# Altium project radxa_cm5_io_board_v2200_SCH-1.PrjPcb (part 3 of 5)

## Sheet 13_USB30_USB20.SchDoc
size 386 x 246 mm
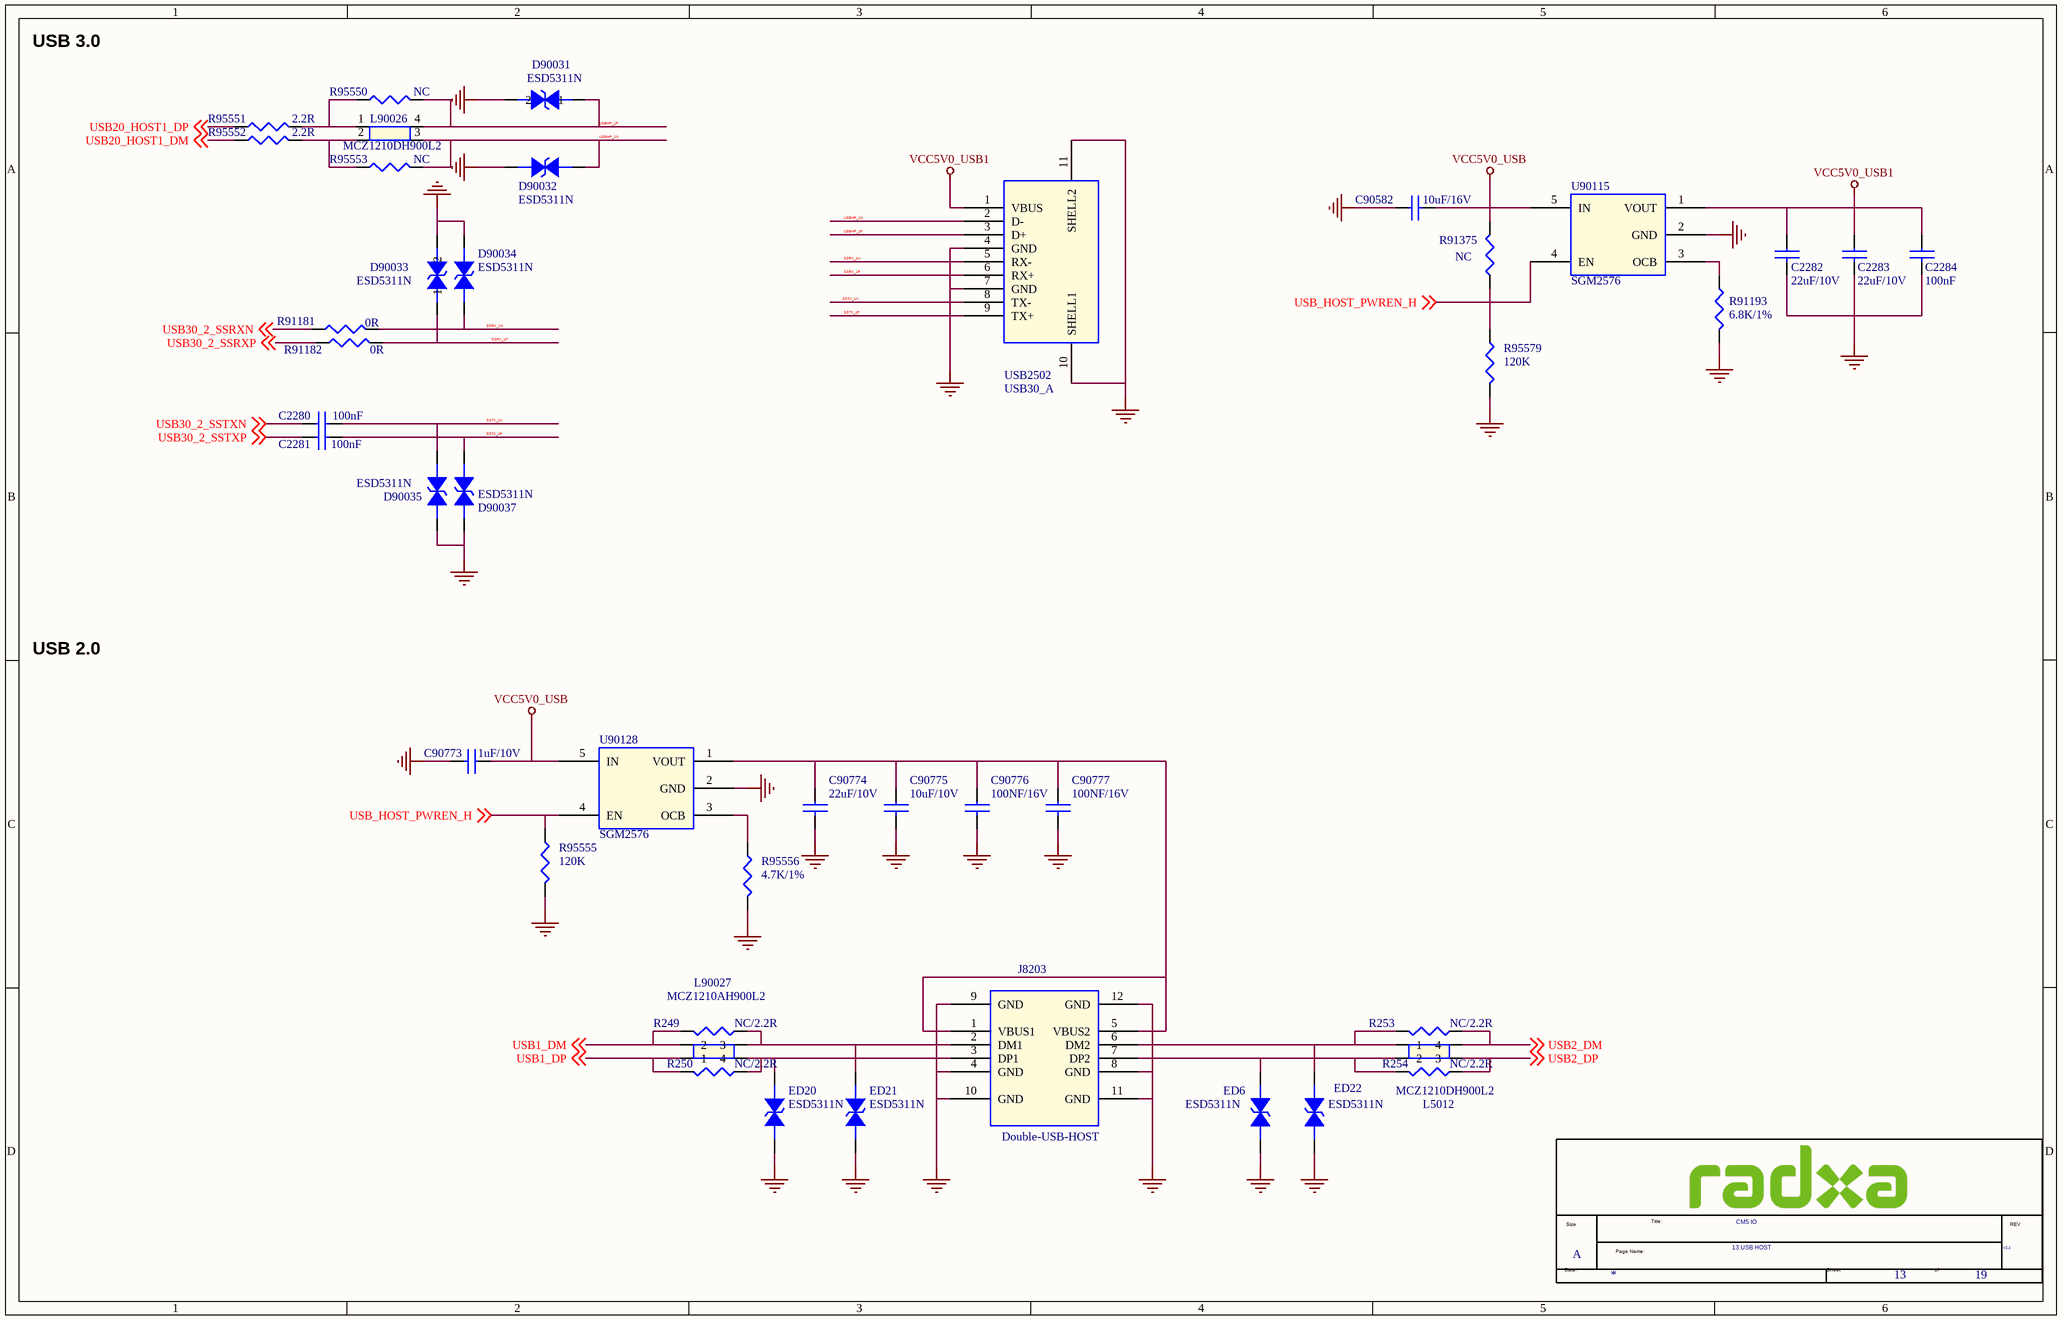
[diagram p12: 13_USB30_USB20.SchDoc]

### Parts
(Parts that share a designator on the sheet are numbered #1, #2 ... from top to bottom, then left to right.)
*#13  Doc: 13.USB HOST  RevCode: V2.2  Title: CM5 IO  Page Size: A  Page Number: 13  Page Count: 19  (hidden comment: radxa_1010)  (graphical)
C2280  100nF  [C0201]
C2281  100nF  [C0201]
C2282  22uF/10V  [C0603]
C2283  22uF/10V  [C0603]
C2284  100nF  [C0201]
C90582  10uF/16V  [C0402]
C90773  1uF/10V  [C0402]
C90774  22uF/10V  [C0603]
C90775  10uF/10V  [C0603]
C90776  100NF/16V  [C0402]
C90777  100NF/16V  [C0402]
D90031  ESD5311N  [ESD0402]
D90032  ESD5311N  [ESD0402]
D90033  ESD5311N  [ESD0402]
D90034  ESD5311N  [ESD0402]
D90035  ESD5311N  [ESD0402]
D90037  ESD5311N  [ESD0402]
ED6  ESD5311N  [ESD0402]
ED20  ESD5311N  [ESD0402]
ED21  ESD5311N  [ESD0402]
ED22  ESD5311N  [ESD0402]
J8203  Double-USB-HOST  [USB_DUAL]
L5012  MCZ1210DH900L2  [MCZ1210AH900L2]
L90026  MCZ1210DH900L2  [MCZ1210AH900L2]
L90027  MCZ1210AH900L2  [MCZ1210AH900L2]
R249  NC/2.2R  [R0402]
R250  NC/2.2R  [R0402]
R253  NC/2.2R  [R0402]
R254  NC/2.2R  [R0402]
R91181  0R  [R0402]
R91182  0R  [R0402]
R91193  6.8K/1%  [R0402]
R91375  NC  [R0402]
R95550  NC  [R0402]
R95551  2.2R  [R0402]
R95552  2.2R  [R0402]
R95553  NC  [R0402]
R95555  120K  [R0402]
R95556  4.7K/1%  [R0402]
R95579  120K  [R0402]
U90115  SGM2576  [SOT_23_5]
U90128  SGM2576  [SOT_23_5]
USB2502  USB30_A  [USB30]

### Nets
GND: C2282.2 C2283.2 C2284.2 C90582.1 C90773.2 C90774.2 C90775.2 C90776.2 C90777.2 D90031.2 D90032.2 D90033.2 D90034.2 D90035.2 D90037.2 ED6.2 ED20.2 ED21.2 ED22.2 J8203.4(GND) J8203.8(GND) J8203.9(GND) J8203.10(GND) J8203.11(GND) J8203.12(GND) R91193.2 R95555.2 R95556.2 R95579.2 U90115.2(GND) U90128.2(GND) USB2502.4(GND) USB2502.7(GND) USB2502.10(SHELL1) USB2502.11(SHELL2)
VCC5V0_USB: C90582.2 C90773.1 R91375.1 U90115.5(IN) U90128.5(IN)
VCC5V0_USB1: C2282.1 C2283.1 C2284.1 U90115.1(VOUT) USB2502.1(VBUS)
SSRX_1N: D90034.1 R91181.2 USB2502.5(RX-)
SSRX_1P: D90033.1 R91182.2 USB2502.6(RX+)
SSTX_1N: C2280.2 D90035.1 USB2502.8(TX-)
SSTX_1P: C2281.2 D90037.1 USB2502.9(TX+)
USB1_DM: L90027.2 R249.2 ; off-sheet USB1_DM
USB1_DP: L90027.1 R250.2 ; off-sheet USB1_DP
USB2_DM: L5012.4 R253.1 ; off-sheet USB2_DM
USB2_DP: L5012.3 R254.1 ; off-sheet USB2_DP
USB20_HOST1_DM: R95552.1 ; off-sheet USB20_HOST1_DM
USB20_HOST1_DP: R95551.1 ; off-sheet USB20_HOST1_DP
USB30_2_SSRXN: R91181.1 ; off-sheet USB30_2_SSRXN
USB30_2_SSRXP: R91182.1 ; off-sheet USB30_2_SSRXP
USB30_2_SSTXN: C2280.1 ; off-sheet USB30_2_SSTXN
USB30_2_SSTXP: C2281.1 ; off-sheet USB30_2_SSTXP
USB_HOST_PWREN_H: R91375.2 R95555.1 R95579.1 U90115.4(EN) U90128.4(EN) ; off-sheet USB_HOST_PWREN_H
USBHP_1N: D90032.1 L90026.3 R95553.2 USB2502.2(D-)
USBHP_1P: D90031.1 L90026.4 R95550.2 USB2502.3(D+)
NetC90774_1: C90774.1 C90775.1 C90776.1 C90777.1 J8203.1(VBUS1) J8203.5(VBUS2) U90128.1(VOUT)
NetED6_1: ED6.1 J8203.7(DP2) L5012.2 R254.2
NetED20_1: ED20.1 J8203.3(DP1) L90027.4 R250.1
NetED21_1: ED21.1 J8203.2(DM1) L90027.3 R249.1
NetED22_1: ED22.1 J8203.6(DM2) L5012.1 R253.2
NetL90026_1: L90026.1 R95550.1 R95551.2
NetL90026_2: L90026.2 R95552.2 R95553.1
NetR91193_1: R91193.1 U90115.3(OCB)
NetR95556_1: R95556.1 U90128.3(OCB)

### Notes on the sheet
- USB 3.0
- USB 2.0
- (in symbol radxa_1010) Size; Title:; REV; Page Name:; Date:; Sheet; of

### Library data of the parts
C2280 = CAP NP_0_Dup1: cap,100.00nF,+/-10%,10V,X5R,C0201; Manufacturer PN: C0603X5R1A104K030BC; Manufacturer: TDK; C_Voltage: 6.3V; Tolerance: 10%; Priority: A; Number: 37; Dielectric: X5R; PCB Footprint: C0201; Voltage: 10V; Created by: JJJ; Part Type: C0201; RK PN: C0603X5R1A104K030BC
C2281 = CAP NP_0_Dup1: cap,100.00nF,+/-10%,10V,X5R,C0201; Manufacturer: TDK; Number: 37; RK PN: C0603X5R1A104K030BC; Priority: A; Tolerance: 10%; C_Voltage: 6.3V; Dielectric: X5R; PCB Footprint: C0201; Voltage: 10V; Part Type: C0201; Manufacturer PN: C0603X5R1A104K030BC; Created by: JJJ
C2282 = CAP NP_0_Dup1: cap,100.00nF,+/-10%,10V,X5R,C0402; Manufacturer: TDK; RK PN: C1005X5R1A104K050BA; Priority: A; Tolerance: 10%; Dielectric: X5R; PCB Footprint: C0603; Voltage: 10V; Part Type: C0402; Manufacturer PN: C1005X5R1A104K050BA; Created by: JJJ
C2283 C2284 = CAP NP_0_Dup1: cap,100.00nF,+/-10%,10V,X5R,C0402; Manufacturer PN: C1005X5R1A104K050BA; Manufacturer: TDK; Tolerance: 10%; Priority: A; Dielectric: X5R; Voltage: 10V; Created by: JJJ; Part Type: C0402; RK PN: C1005X5R1A104K050BA
  C2283: PCB Footprint: C0603
  C2284: PCB Footprint: C0201
C90582 = C / 10 / uF / 0402_0: 0402 ∮20% 10uF X5R 6.3V; FunctionGroup: Petrus / PMIC; Vendor: Murata; Vendor_PN: GRM155R60J106ME05; FS: Y; PCB Footprint: C0603; Property1: ∮20%; Property2: X5R; Property3: 6.3V; EBOM: C / 10 / uF / 0402
C90773 = CAP NP_0_Dup2: cap,1.00uF,+/-10%,10V,X5R,C0402; Manufacturer PN: C1005X5R1A105K050BB; Manufacturer: TDK; Tolerance: 10%; C_Voltage: 6.3V; Priority: A; Voltage: 10V; PCB Footprint: C0402; Dielectric: X5R; Created by: JJJ; Part Type: C0402; RK PN: C1005X5R1A105K050BB
C90774 = CAP NP_0_Dup2: cap,22.00uF,+/-20%,10V,X5R,C0603; Manufacturer PN: C1608X5R1A226M080AC; Manufacturer: TDK; Tolerance: 20%; Priority: A; Voltage: 10V; PCB Footprint: C0603; Dielectric: X5R; Created by: JJJ; Part Type: C0603; RK PN: C1608X5R1A226M080AC
C90775 = CAP NP_0_Dup2: cap,10.00uF,+/-10%,10V,X5R,C0603; Manufacturer: TDK; RK PN: C1608X5R1A106K080AC; Priority: A; Tolerance: 10%; Voltage: 10V; PCB Footprint: C0603; Dielectric: X5R; Part Type: C0603; Manufacturer PN: C1608X5R1A106K080AC; Created by: JJJ
C90776 C90777 = CAP NP_0_Dup2: cap,100.00nF,+/-10%,16V,X5R,C0402; Manufacturer: TDK; RK PN: C1005X5R1C104K050BA; Priority: A; Tolerance: 10%; Voltage: 16V; PCB Footprint: C0402; Dielectric: X5R; Part Type: C0402; Manufacturer PN: C1005X5R1C104K050BA; Created by: JJJ
D90031 = DIODE BI_DIR TRIG_0: 1-Line, Bi-directional, Transient Voltage Suppressors.1pF.; Manufacturer: WillSemi(韦尔半导体); Manufacturer PN: ESD5341N; Priority: A; PCB Footprint: ESD0402; Created by: JJJ; Part Type: ESD_TVS; RK PN: ESD5341N
D90032 D90034 ED22 = DIODE BI_DIR TRIG_1_Dup1: 1-Line, Bi-directional, Transient Voltage Suppressors.1pF.; Manufacturer: WillSemi(韦尔半导体); Manufacturer PN: ESD5341N; Priority: A; PCB Footprint: ESD0402; Created by: JJJ; Part Type: ESD_TVS; RK PN: ESD5341N
D90033 = DIODE BI_DIR TRIG_1: 1-Line, Bi-directional, Transient Voltage Suppressors.1pF.; Manufacturer: WillSemi(韦尔半导体); Manufacturer PN: ESD5341N; Priority: A; PCB Footprint: ESD0402; Created by: JJJ; Part Type: ESD_TVS; RK PN: ESD5341N
D90035 D90037 ED6 ED20 ED21 = DIODE BI_DIR TRIG_1_Dup1: 1-Line, Bi-directional, Transient Voltage Suppressors.1pF.; Manufacturer: WillSemi(韦尔半导体); RK PN: ESD5341N; Priority: A; PCB Footprint: ESD0402; Part Type: ESD_TVS; Manufacturer PN: ESD5341N; Created by: JJJ
J8203 = Double-USB: PCB Footprint: USB_DUAL
L5012 L90027 = MCZ1210AH900L2_3: PCB Footprint: MCZ1210AH900L2
L90026 = MCZ1210AH900L2_1_Dup1: PCB Footprint: MCZ1210AH900L2
R249 R250 R253 R254 = RESISTOR_1_Dup1: 通用厚膜电阻,2R2,+/-5%,R0402,1/16W.; Manufacturer: YAGEO; Tolerance: 5%; RK PN: RC0402JR-072R2L; Priority: A; Wattage: 1/16W; PCB Footprint: R0402; Part Type: 通用厚膜电阻; Manufacturer PN: RC0402JR-072R2L; Created by: YTL
R91181 = RESISTOR_0_Dup1: 通用厚膜电阻,0R,+/-5%,R0201,1/20W.; Manufacturer PN: RC0201JR-070RL; Manufacturer: YAGEO; Tolerance: 5%; Wattage: 1/20W; Priority: A; PCB Footprint: R0201; Created by: YTL; Part Type: 通用厚膜电阻; RK PN: RC0201JR-070RL
R91182 = RESISTOR_0_Dup1: 通用厚膜电阻,0R,+/-5%,R0201,1/20W.; Manufacturer: YAGEO; Tolerance: 5%; RK PN: RC0201JR-070RL; Priority: A; Wattage: 1/20W; PCB Footprint: R0201; Part Type: 通用厚膜电阻; Manufacturer PN: RC0201JR-070RL; Created by: YTL
R91193 = RESISTOR_0_Dup1: 通用厚膜电阻,4K7,+/-5%,R0402,1/16W.; Manufacturer: YAGEO; Tolerance: 1%; PCB Footprint: R0201; RK PN: RC0402JR-074K7L; Priority: A; Wattage: 1/16W; Part Type: 通用厚膜电阻; Manufacturer PN: RC0402JR-074K7L; Created by: YTL
R91375 = RESISTOR_0_Dup1: Did Not Place.; Manufacturer PN: DNP0402; Tolerance: 0%; PCB Footprint: R0201; Priority: A; Created by: JJJ; Part Type: DNP; RK PN: DNP0402
R95550 R95552 R95553 = RESISTOR_0_Dup1: 通用厚膜电阻,2R2,+/-5%,R0402,1/16W.; Manufacturer PN: RC0402JR-072R2L; Manufacturer: YAGEO; Tolerance: 5%; Wattage: 1/16W; Priority: A; PCB Footprint: R0402; Created by: YTL; Part Type: 通用厚膜电阻; RK PN: RC0402JR-072R2L
R95551 = RESISTOR_0_Dup1: 通用厚膜电阻,2R2,+/-5%,R0402,1/16W.; Manufacturer: YAGEO; Tolerance: 5%; RK PN: RC0402JR-072R2L; Priority: A; Wattage: 1/16W; PCB Footprint: R0402; Part Type: 通用厚膜电阻; Manufacturer PN: RC0402JR-072R2L; Created by: YTL
R95555 R95579 = RESISTOR_1_Dup1: 通用厚膜电阻,100K,+/-5%,R0402,1/16W.; Manufacturer PN: RC0402JR-07100KL; Manufacturer: YAGEO; PCB Footprint: R0201; Tolerance: 5%; Wattage: 1/16W; Priority: A; Created by: YTL; Part Type: 通用厚膜电阻; RK PN: RC0402JR-07100KL
R95556 = RESISTOR_1_Dup1: 通用厚膜电阻,10K,+/-1%,R0402,1/16W.; Manufacturer PN: RC0402FR-0710KL; Manufacturer: YAGEO; PCB Footprint: R0201; Tolerance: 1%; Wattage: 1/16W; Priority: A; Created by: YTL; Part Type: 通用厚膜电阻; RK PN: RC0402FR-0710KL
U90115 U90128 = SWITCH_SY6280: Low Loss Power Distribution Switch; Manufacturer: Silergy（矽力杰）; RK PN: SY6280AAC; Priority: A; PCB Footprint: SOT_23_5; Part Type: Switch; Manufacturer PN: SY6280AAC; Created by: JJJ
USB2502 = USB30_TYPE_A: A型USB3.0座，卧式，插焊; Manufacturer: 旺科达; PCB Footprint: USB30-L1; RK PN: USB-HOST_30; Priority: A; Part Type: USB Jack; Manufacturer Part Number: USB30_A; Created by: JJJ
*#13 = radxa_1010: Page Create Date: March  8, 1995; Page Modify Date: *

## Sheet 14_FAN_RTC.SchDoc
size 297 x 209 mm
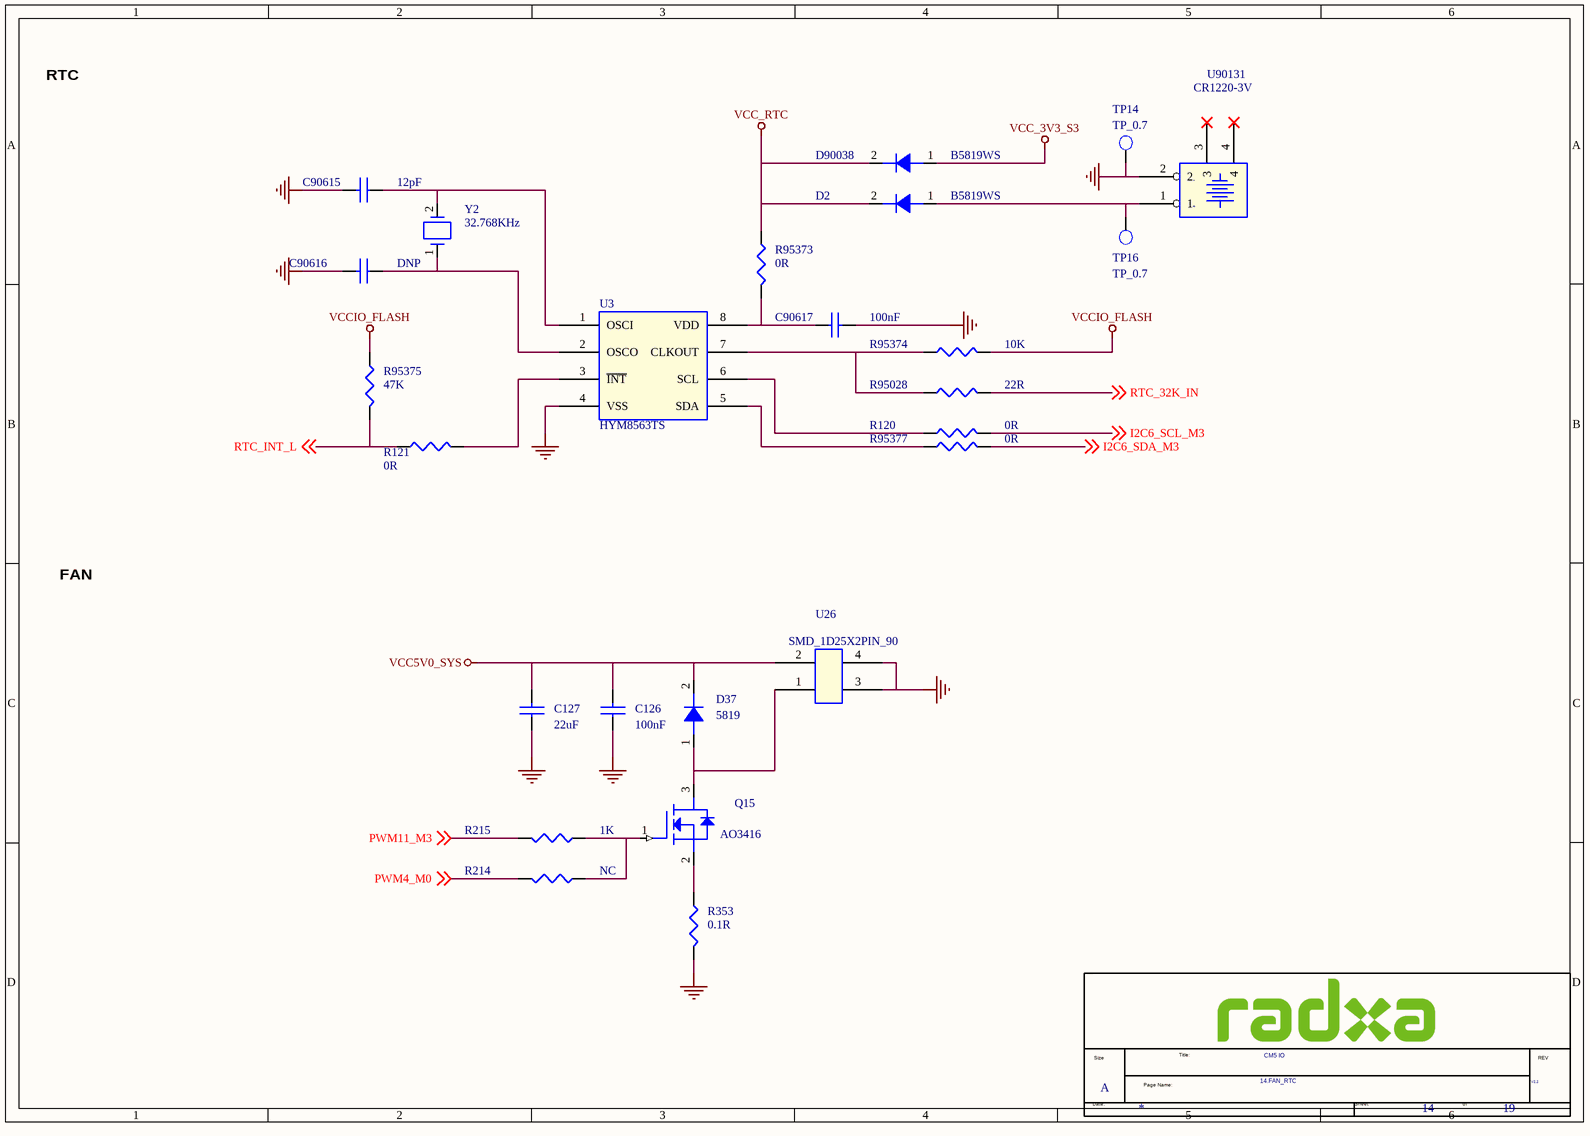
[diagram p13: 14_FAN_RTC.SchDoc]

### Parts
(Parts that share a designator on the sheet are numbered #1, #2 ... from top to bottom, then left to right.)
*#14  Doc: 14.FAN_RTC  RevCode: V2.2  Title: CM5 IO  Page Size: A  Page Number: 14  Page Count: 19  (hidden comment: radxa_1010)  (graphical)
C126  100nF  [C0402]
C127  22uF  [C0603]
C90615  12pF  [C0402]
C90616  DNP  [C0402]
C90617  100nF  [C0402]
D2  B5819WS  [SOD_323]
D37  5819  [SOD_123]
D90038  B5819WS  [SOD_323]
Q15  AO3416  [SOT23]
R120  0R  [R0402]
R121  0R  [R0402]
R214  NC  [R0402]
R215  1K  [R0402]
R353  0.1R  [R0402]
R95028  22R  [R0402]
R95373  0R  [R0402]
R95374  10K  [R0402]
R95375  47K  [R0402]
R95377  0R  [R0402]
TP14  TP_0.7  [TEST]
TP16  TP_0.7  [TEST]
U3  HYM8563TS  [TSSOP8_3R10X3R10X1R10]
U26  SMD_1D25X2PIN_90  [SMD_1D25X2PIN_90]
U90131  CR1220-3V  [BATTERY-20MM]
Y2  32.768KHz  [3215_2pin]

### Nets
GND: C126.1 C127.1 C90615.2 C90616.2 C90617.2 R353.2 TP14.1 U3.4(VSS) U26.3 U26.4 U90131.2
VCC5V0_SYS: C126.2 C127.2 D37.2(K) U26.2
VCC_3V3_S3: D90038.1(A)
VCC_RTC: D2.2(K) D90038.2(K) R95373.1
VCCIO_FLASH: R95374.2 R95375.1
I2C6_SCL_M3: R120.2 ; off-sheet I2C6_SCL_M3
I2C6_SDA_M3: R95377.2 ; off-sheet I2C6_SDA_M3
PWM4_M0: R214.2 ; off-sheet PWM4_M0
PWM11_M3: R215.2 ; off-sheet PWM11_M3
RTC_32K_IN: R95028.2 ; off-sheet RTC_32K_IN
RTC_INT_L: R121.1 R95375.2 ; off-sheet RTC_INT_L
NetC90615_1: C90615.1 U3.1(OSCI) Y2.2
NetC90616_1: C90616.1 U3.2(OSCO) Y2.1
NetC90617_1: C90617.1 R95373.2 U3.8(VDD)
NetD2_1: D2.1(A) TP16.1 U90131.1
NetD37_1: D37.1(A) Q15.3(DRAIN) U26.1
NetQ15_1: Q15.1(GATE) R214.1 R215.1
NetQ15_2: Q15.2(SOURCE) R353.1
NetR120_1: R120.1 U3.6(SCL)
NetR121_2: R121.2 U3.3(~{INT})
NetR95028_1: R95028.1 R95374.1 U3.7(CLKOUT)
NetR95377_1: R95377.1 U3.5(SDA)

Not connected (* = marked no-connect by the designer): U90131 3* 4*

### Notes on the sheet
- RTC
- FAN
- (in symbol CON_BATTERY-20MM_0) -; +
- (in symbol radxa_1010) Size; Title:; REV; Page Name:; Date:; Sheet; of

### Library data of the parts
C126 = CAP NP_0: cap,100.00nF,+/-10%,16V,X5R,C0402; Manufacturer PN: C1005X5R1C104K050BA; Manufacturer: TDK; Voltage: 25V; Tolerance: 10%; Priority: A; PCB Footprint: C0402; Dielectric: X5R; Created by: JJJ; Part Type: C0402; RK PN: C1005X5R1C104K050BA
C127 = CAP NP_0: cap,22.00uF,+/-10%,10V,X5R,C0805; Manufacturer: TDK; Voltage: 25V; RK PN: C2012X5R1A226K125AB; Priority: A; Tolerance: 10%; PCB Footprint: C0603; Dielectric: X5R; Part Type: C0805; Manufacturer PN: C2012X5R1A226K125AB; Created by: JJJ
C90615 = CAP NP_0: cap,12.00pF,+/-5%,50V,C0G,C0402; Manufacturer: TDK; RK PN: C1005C0G1H120J050BA; Priority: A; Tolerance: 5%; Voltage: 50V; PCB Footprint: C0402; Dielectric: C0G; Part Type: C0402; Manufacturer PN: C1005C0G1H120J050BA; Created by: JJJ
C90616 = CAP NP_0: Did Not Place.; Manufacturer PN: DNPC0402; Priority: A; PCB Footprint: C0402; Created by: JJJ; Part Type: DNP; RK PN: DNPC0402
C90617 = CAP NP_0: cap,100.00nF,+/-10%,16V,X5R,C0402; Manufacturer PN: C1005X5R1C104K050BA; Manufacturer: TDK; C_Voltage: 6.3V; Tolerance: 10%; Priority: A; Number: 37; Voltage: 16V; PCB Footprint: C0402; Dielectric: X5R; Created by: JJJ; Part Type: C0402; RK PN: C1005X5R1C104K050BA
D2 D37 D90038 = DIODE_Dup1: Schottky Barrier，B5819WS SOD-323; Manufacturer: 长电; Priority: A; Created by: JJJ; Manufacturer PN: B5819WS; Part Type: Schottky rectifier; RK PN: B5819WS
  D2 D90038: PCB Footprint: SOD_323
  D37: PCB Footprint: SOD_123
Q15 = MOSFET N: MOSFET-N,WNM3003 ,30V,+/-20V,4.0A,33m Ohm@Vgs=10V,43m Ohm@Vgs=4.5V,SOT23; PCB Footprint: SOT23
R120 R121 = RESISTOR_1: 通用厚膜电阻,0R,+/-5%,R0402,1/16W.; Manufacturer: YAGEO; Tolerance: 5%; RK PN: RC0402JR-070RL; Priority: A; Wattage: 1/16W; PCB Footprint: R0402; Part Type: 通用厚膜电阻; Manufacturer PN: RC0402JR-070RL; Created by: YTL
R214 R95375 = RESISTOR_1: 通用厚膜电阻,47K,+/-5%,R0402,1/16W.; Manufacturer: YAGEO; Tolerance: 5%; RK PN: RC0402JR-0747KL; Priority: A; Wattage: 1/16W; PCB Footprint: R0402; Part Type: 通用厚膜电阻; Manufacturer PN: RC0402JR-0747KL; Created by: YTL
R215 = RESISTOR_1: 通用厚膜电阻,47K,+/-5%,R0402,1/16W.; Manufacturer PN: RC0402JR-0747KL; Manufacturer: YAGEO; Tolerance: 5%; Wattage: 1/16W; Priority: A; PCB Footprint: R0402; Created by: YTL; Part Type: 通用厚膜电阻; RK PN: RC0402JR-0747KL
R353 = RESISTOR_0: 通用厚膜电阻,10K,+/-5%,R0402,1/16W.; Manufacturer PN: RC0402JR-0710KL; Manufacturer: YAGEO; PCB Footprint: R1206; Tolerance: 5%; Wattage: 1/16W; Priority: A; Created by: YTL; Part Type: 通用厚膜电阻; RK PN: RC0402JR-0710KL
R95028 = RESISTOR_1: 通用厚膜电阻,10K,+/-5%,R0402,1/16W.; Manufacturer PN: RC0402JR-0710KL; Manufacturer: YAGEO; Tolerance: 5%; Wattage: 1/16W; Priority: A; PCB Footprint: R0402; Created by: YTL; Part Type: 通用厚膜电阻; RK PN: RC0402JR-0710KL
R95373 = RESISTOR_1: 通用厚膜电阻,0R,+/-1%,R0603,1/10W.; Manufacturer PN: RC0603FR-070RL; Manufacturer: YAGEO; Tolerance: 1%; Wattage: 1/10W; Priority: A; PCB Footprint: R0603; Created by: YTL; Part Type: 通用厚膜电阻; RK PN: RC0603FR-070RL
R95374 = RESISTOR_1: 通用厚膜电阻,10K,+/-5%,R0402,1/16W.; Manufacturer: YAGEO; Tolerance: 5%; RK PN: RC0402JR-0710KL; Priority: A; Wattage: 1/16W; PCB Footprint: R0402; Part Type: 通用厚膜电阻; Manufacturer PN: RC0402JR-0710KL; Created by: YTL
R95377 = RESISTOR_1: 通用厚膜电阻,0R,+/-5%,R0402,1/16W.; Manufacturer PN: RC0402JR-070RL; Manufacturer: YAGEO; Tolerance: 5%; Wattage: 1/16W; Priority: A; PCB Footprint: R0402; Created by: YTL; Part Type: 通用厚膜电阻; RK PN: RC0402JR-070RL
TP14 = TP: Test Point 0.7mm; PCB Footprint: TP_0R70; RK PN: TESTPOINT_0R7; Priority: A; Part Type: TP; Created by: JJJ
TP16 = TP: Test Point 0.7mm; PCB Footprint: TP_0R70; Priority: A; RK PN: TESTPOINT_0R7; Created by: JJJ; Part Type: TP
U3 = RTC_HYM8563: I2C Real Time Clock/Calendar; Manufacturer: Haoyu（昊昱微电子）; Priority: A; PCB Footprint: TSSOP8_3R10X3R10X1R10; Created by: JJJ; Manufacturer PN: HYM8563TS; Part Type: RTC; RK PN: HYM8563TS
U26 = CON3_6: PCB Footprint: SMD_1D25X2PIN_90
U90131 = CON_BATTERY-20MM_0: PCB Footprint: BAT_CR1220
Y2 = CRYSTAL_2P: 无源晶振，32.768KHz,±20ppm，12.5pF; Manufacturer: TKD(泰晶); RK PN: SF-3215; Priority: A; PCB Footprint: 3215_2pin; Part Type: CRYSTAL; Manufacturer PN: SF-3215; Created by: YWQ
*#14 = radxa_1010: Page Create Date: March  8, 1995; Page Modify Date: *

## Sheet 15_Power_DCIN.SchDoc
size 420 x 297 mm
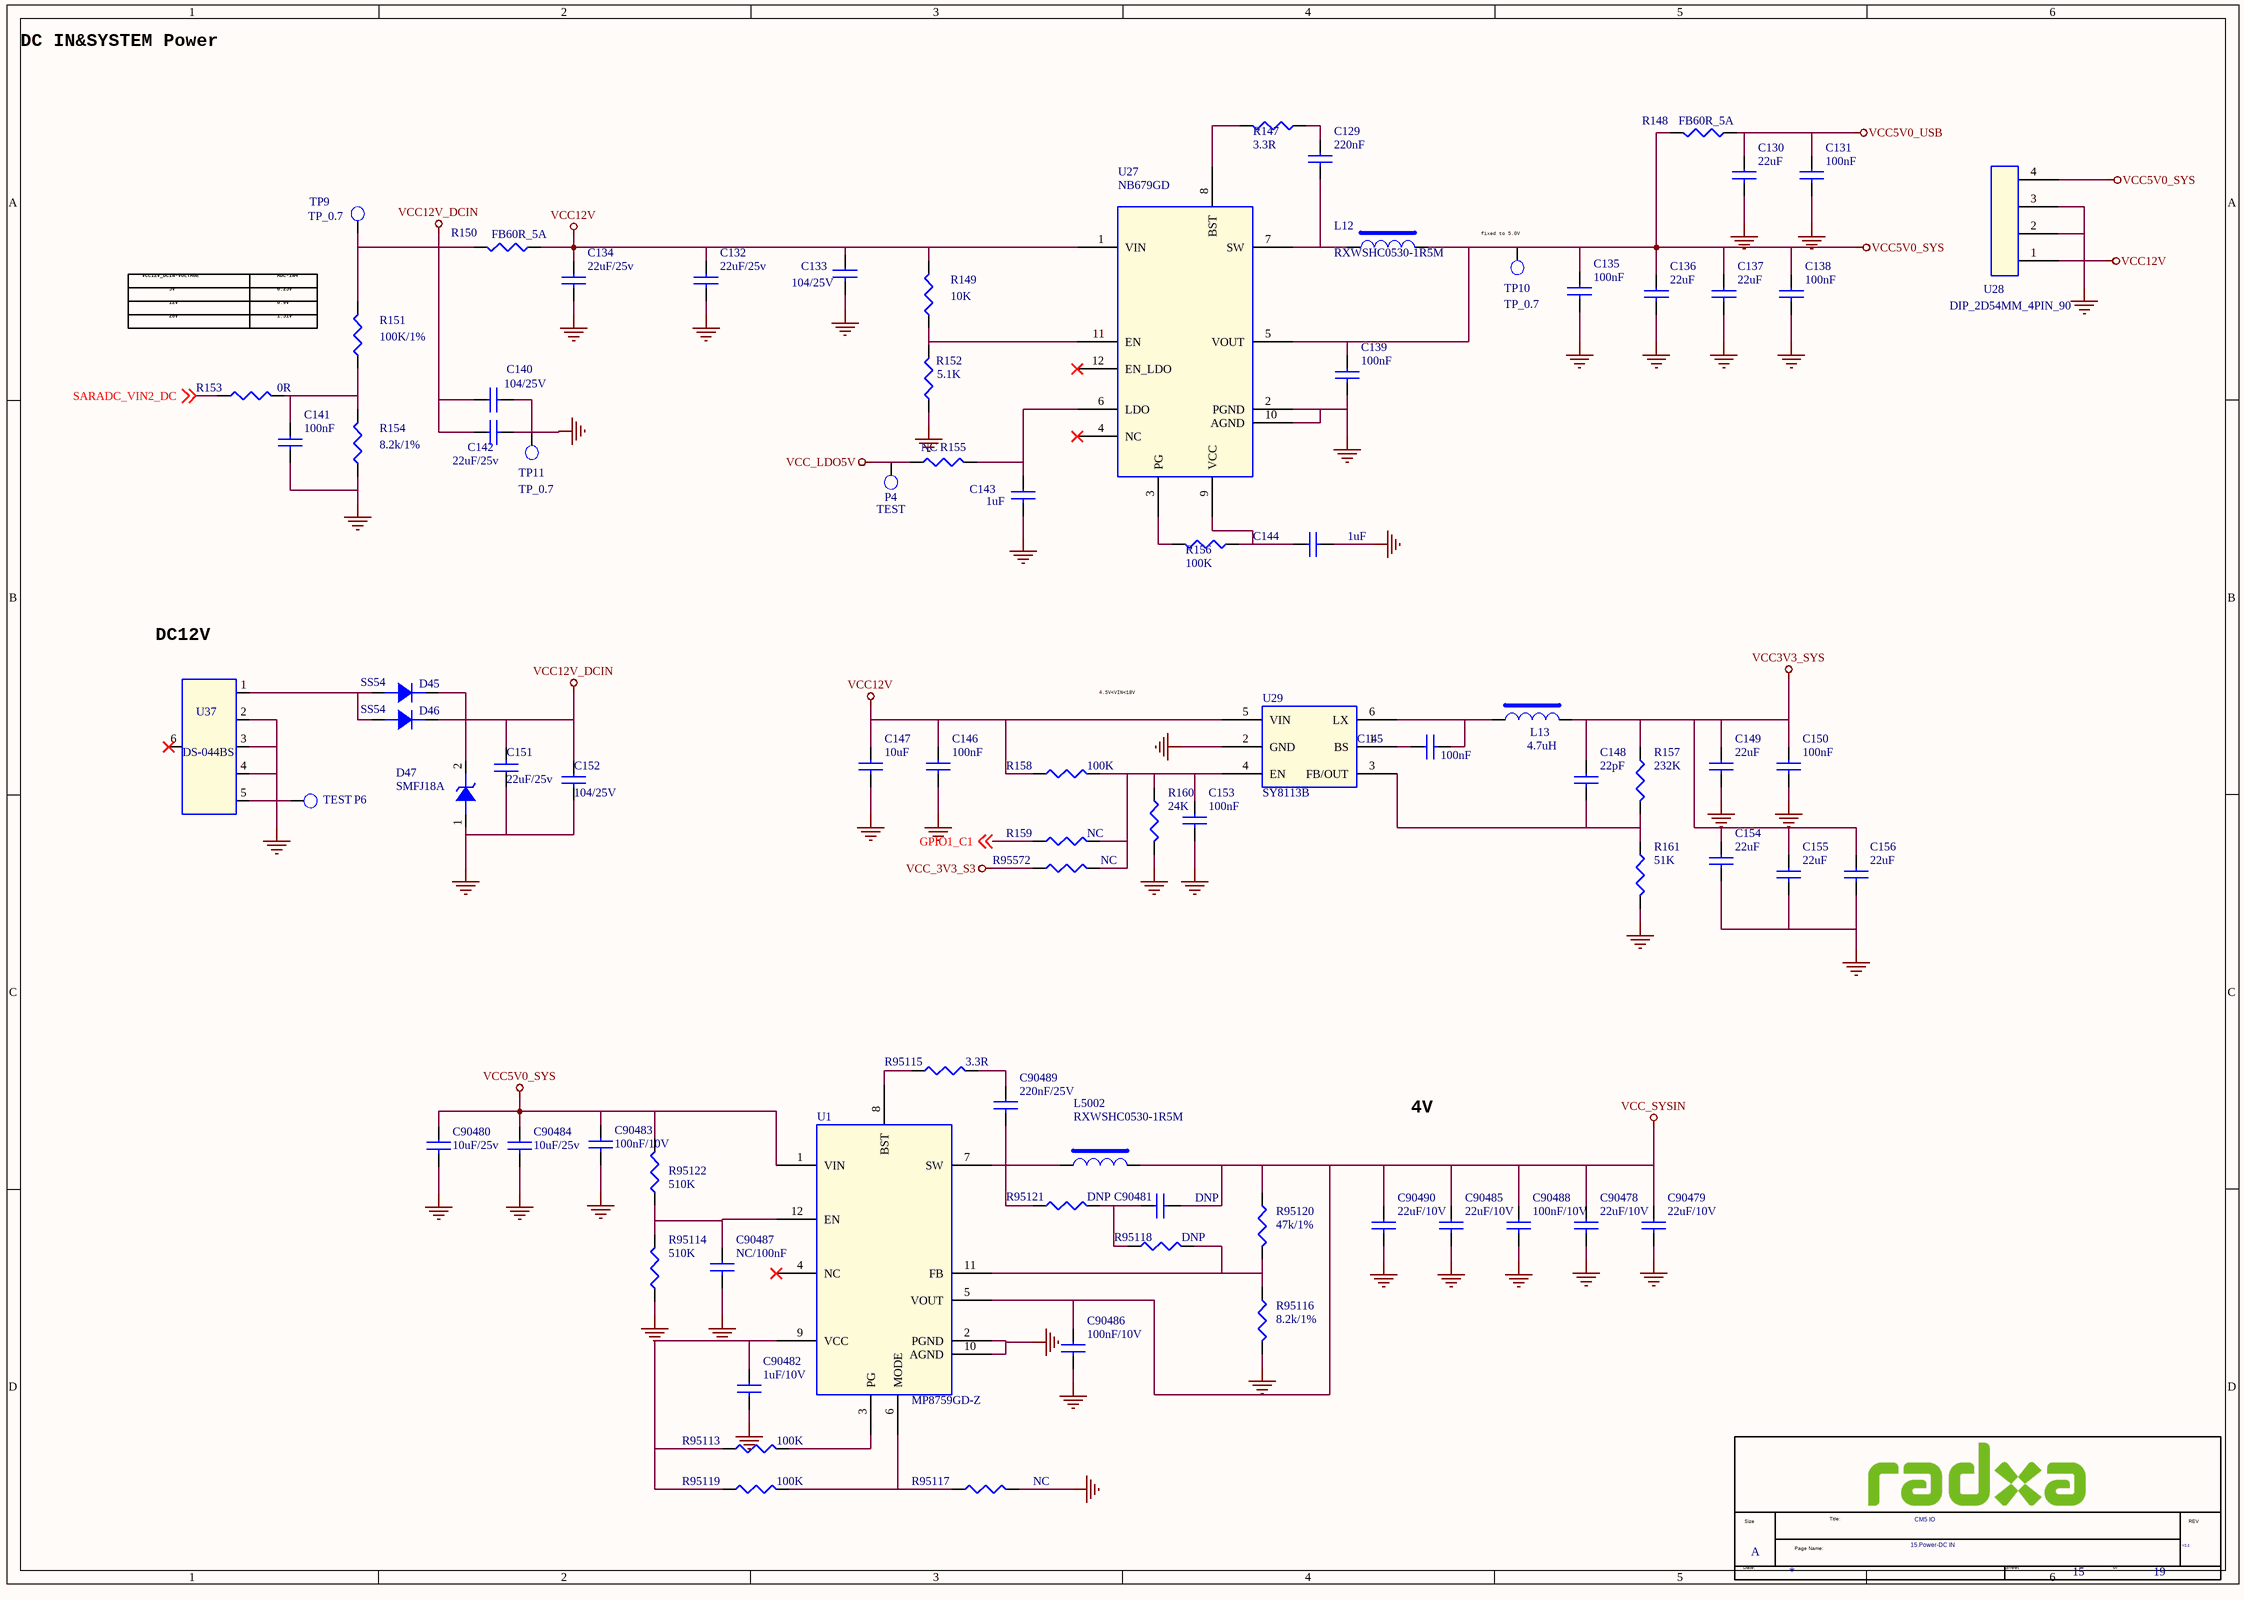
[diagram p14: 15_Power_DCIN.SchDoc]

### Parts
(Parts that share a designator on the sheet are numbered #1, #2 ... from top to bottom, then left to right.)
*#15  Doc: 15.Power-DC IN  RevCode: V2.2  Title: CM5 IO  Page Size: A  Page Number: 15  Page Count: 19  (hidden comment: radxa_1010)  (graphical)
C129  220nF  [C0402]
C130  22uF  [C0603]
C131  100nF  [C0402]
C132  22uF/25v  [C0805]
C133  104/25V  [C0402]
C134  22uF/25v  [C0805]
C135  100nF  [C0402]
C136  22uF  [C0603]
C137  22uF  [C0603]
C138  100nF  [C0402]
C139  100nF  [C0402]
C140  104/25V  [C0402]
C141  100nF  [C0402]
C142  22uF/25v  [C0805]
C143  1uF  [C0402]
C144  1uF  [C0402]
C145  100nF  [C0402]
C146  100nF  [C0402]
C147  10uF  [C1206]
C148  22pF  [C0402]
C149  22uF  [C0805]
C150  100nF  [C0402]
C151  22uF/25v  [C0805]
C152  104/25V  [C0402]
C153  100nF  [C0402]
C154  22uF  [C0805]
C155  22uF  [C0805]
C156  22uF  [C0805]
C90478  22uF/10V  [C0805]
C90479  22uF/10V  [C0805]
C90480  10uF/25v  [C1206]
C90481  DNP  [C0201]
C90482  1uF/10V  [C0201]
C90483  100nF/10V  [C0402]
C90484  10uF/25v  [C1206]
C90485  22uF/10V  [C0805]
C90486  100nF/10V  [C0201]
C90487  NC/100nF  [C0201]
C90488  100nF/10V  [C0402]
C90489  220nF/25V  [C0402]
C90490  22uF/10V  [C0805]
D45  SS54  [DO_214AC]
D46  SS54  [DO_214AC]
D47  SMFJ18A  [SOD_123]
L12  RXWSHC0530-1R5M  [IND-5020]
L13  4.7uH  [IND-5020]
L5002  RXWSHC0530-1R5M  [IND-5020]
P4  TEST  [TEST]
P6  TEST  [TEST]
R147  3.3R  [R0402]
R148  FB60R_5A  [R1206]
R149  10K  [R0402]
R150  FB60R_5A  [R1206]
R151  100K/1%  [R0402]
R152  5.1K  [R0402]
R153  0R  [R0402]
R154  8.2k/1%  [R0402]
R155  NC  [R0402]
R156  100K  [R0402]
R157  232K  [R0402]
R158  100K  [R0402]
R159  NC  [R0402]
R160  24K  [R0402]
R161  51K  [R0402]
R95113  100K  [R0402]
R95114  510K  [R0402]
R95115  3.3R  [R0402]
R95116  8.2k/1%  [R0402]
R95117  NC  [R0402]
R95118  DNP  [R0402]
R95119  100K  [R0402]
R95120  47k/1%  [R0402]
R95121  DNP  [R0402]
R95122  510K  [R0402]
R95572  NC  [R0402]
TP9  TP_0.7  [TEST]
TP10  TP_0.7  [TEST]
TP11  TP_0.7  [TEST]
U1  MP8759GD-Z  [QFN12_2R00X3R00X1R00]
U27  NB679GD  [QFN12_3R00X2R00X0R90]
U28  DIP_2D54MM_4PIN_90  [XIAO_4PIN_2D54]
U29  SY8113B  [SOT_23_6]
U37  DS-044BS  [DC-044A]

### Nets
GND: C130.2 C131.2 C132.2 C133.2 C134.2 C135.2 C136.2 C137.2 C138.2 C139.2 C140.2 C141.2 C142.2 C143.2 C144.2 C146.2 C147.2 C149.2 C150.2 C151.1 C152.2 C153.2 C154.2 C155.2 C156.2 C90478.2 C90479.2 C90480.2 C90482.2 C90483.2 C90484.2 C90485.2 C90486.2 C90487.2 C90488.2 C90490.2 D47.1(ANODE) P6.1 R152.1 R154.1 R160.2 R161.2 R95114.1 R95116.2 R95117.2 TP11.1 U1.2(PGND) U1.10(AGND) U27.2(PGND) U27.10(AGND) U28.2 U28.3 U29.2(GND) U37.2 U37.3 U37.4 U37.5
VCC3V3_SYS: C148.1 C149.1 C150.1 C154.1 C155.1 C156.1 L13.2 R157.1
VCC5V0_SYS: C135.1 C136.1 C137.1 C138.1 C139.1 C90480.1 C90483.1 C90484.1 L12.2 R148.2 R95122.2 TP10.1 U1.1(VIN) U27.5(VOUT) U28.4
VCC5V0_USB: C130.1 C131.1 R148.1
VCC12V: C132.1 C133.1 C134.1 C146.1 C147.1 R149.2 R150.1 R158.1 U27.1(VIN) U28.1 U29.5(VIN)
VCC12V_DCIN: C140.1 C142.1 C151.2 C152.1 D45.2(K) D46.2(K) D47.2(CATHODE) R150.2 R151.2 TP9.1
VCC_3V3_S3: R95572.1
VCC_LDO5V: P4.1 R155.1
VCC_SYSIN: C90478.1 C90479.1 C90481.2 C90485.1 C90486.1 C90488.1 C90490.1 L5002.2 R95120.1 U1.5(VOUT)
GPIO1_C1: R159.1 ; off-sheet GPIO1_C1
SARADC_VIN2_DC: R153.1 ; off-sheet SARADC_VIN2_DC
NetC129_1: C129.1 R147.2
NetC129_2: C129.2 L12.1 U27.7(SW)
NetC141_1: C141.1 R151.1 R153.2 R154.2
NetC143_1: C143.1 R155.2 U27.6(LDO)
NetC144_1: C144.1 R156.2 U27.9(VCC)
NetC145_1: C145.1 U29.1(BS)
NetC145_2: C145.2 L13.1 U29.6(LX)
NetC148_2: C148.2 R157.2 R161.1 U29.3(FB/OUT)
NetC153_1: C153.1 R158.2 R159.2 R160.1 R95572.2 U29.4(EN)
NetC90481_1: C90481.1 R95118.1 R95121.2
NetC90482_1: C90482.1 R95113.1 R95119.1 U1.9(VCC)
NetC90487_1: C90487.1 R95114.2 R95122.1 U1.12(EN)
NetC90489_1: C90489.1 R95115.2
NetC90489_2: C90489.2 L5002.1 R95121.1 U1.7(SW)
NetD45_1: D45.1(A) D46.1(A) U37.1
NetR147_1: R147.1 U27.8(BST)
NetR149_1: R149.1 R152.2 U27.11(EN)
NetR156_1: R156.1 U27.3(PG)
NetR95113_2: R95113.2 U1.3(PG)
NetR95115_1: R95115.1 U1.8(BST)
NetR95116_1: R95116.1 R95118.2 R95120.2 U1.11(FB)
NetR95117_1: R95117.1 R95119.2 U1.6(MODE)

Not connected (* = marked no-connect by the designer): U1 4(NC)*; U27 4(NC)* 12(EN_LDO)*; U37 6*

### Notes on the sheet
- DC IN&SYSTEM Power
- (near TP10) fixed to 5.0V
- VCC12V_DCIN-VOLTAGE
- 5V
- 12V
- 20V
- 0.25V
- 1.51V
- ADC-IN4
- 0.9V
- (near U37) DC12V
- 4.5V<VIN<18V
- 4V
- (in symbol radxa_1010) Size; Title:; REV; Page Name:; Date:; Sheet; of

### Library data of the parts
C129 = CAP NP_0: cap,220.00nF,+/-10%,25V,X5R,C0402; Manufacturer PN: C1005X5R1E224K050BC; Manufacturer: TDK; Tolerance: 10%; Priority: A; Voltage: 25V; PCB Footprint: C0402; Dielectric: X5R; Created by: JJJ; Part Type: C0402; RK PN: C1005X5R1E224K050BC
C130 C136 C137 = CAP NP_0: cap,22.00uF,+/-10%,10V,X5R,C0805; Manufacturer: TDK; RK PN: C2012X5R1A226K125AB; Priority: A; Tolerance: 10%; Voltage: 10V; PCB Footprint: C0603; Dielectric: X5R; Part Type: C0805; Manufacturer PN: C2012X5R1A226K125AB; Created by: JJJ
C131 C135 C138 C139 = CAP NP_0: cap,100.00nF,+/-10%,16V,X5R,C0402; Manufacturer PN: C1005X5R1C104K050BA; Manufacturer: TDK; Tolerance: 10%; Priority: A; Voltage: 16V; PCB Footprint: C0402; Dielectric: X5R; Created by: JJJ; Part Type: C0402; RK PN: C1005X5R1C104K050BA
C132 C142 = CAP NP_0: cap,10.00uF,+/-10%,16V,X5R,C0805; Manufacturer: TDK; RK PN: C2012X5R1C106K125AC; Priority: A; Tolerance: 10%; Voltage: 16V; PCB Footprint: C0805; Dielectric: X5R; Part Type: C0805; Manufacturer PN: C2012X5R1C106K125AC; Created by: JJJ
C133 C140 = CAP NP_0: cap,1.00uF,+/-10%,16V,X5R,C0402; Manufacturer PN: C1005X5R1C105K050BC; Manufacturer: TDK; Voltage: 25V; Tolerance: 10%; Priority: A; PCB Footprint: C0402; Dielectric: X5R; Created by: JJJ; Part Type: C0402; RK PN: C1005X5R1C105K050BC
C134 = CAP NP_0: cap,10.00uF,+/-10%,16V,X5R,C0805; Manufacturer PN: C2012X5R1C106K125AC; Manufacturer: TDK; Tolerance: 10%; Priority: A; Voltage: 16V; PCB Footprint: C0805; Dielectric: X5R; Created by: JJJ; Part Type: C0805; RK PN: C2012X5R1C106K125AC
C141 = CAP NP_0: cap,100.00nF,+/-10%,16V,X5R,C0402; Manufacturer: TDK; RK PN: C1005X5R1C104K050BA; Priority: A; Tolerance: 10%; Voltage: 16V; PCB Footprint: C0402; Dielectric: X5R; Part Type: C0402; Manufacturer PN: C1005X5R1C104K050BA; Created by: JJJ
C143 = CAP NP_0: cap,1.00uF,+/-10%,16V,X5R,C0402; Manufacturer: TDK; RK PN: C1005X5R1C105K050BC; Priority: A; Tolerance: 10%; Voltage: 16V; PCB Footprint: C0402; Dielectric: X5R; Part Type: C0402; Manufacturer PN: C1005X5R1C105K050BC; Created by: JJJ
C144 = CAP NP_0: cap,1.00uF,+/-10%,16V,X5R,C0402; Manufacturer PN: C1005X5R1C105K050BC; Manufacturer: TDK; Tolerance: 10%; Priority: A; Voltage: 16V; PCB Footprint: C0402; Dielectric: X5R; Created by: JJJ; Part Type: C0402; RK PN: C1005X5R1C105K050BC
C145 = CAP NP_0: cap,100.00nF,+/-10%,25V,X5R,C0402; Manufacturer: TDK; Number: 37; RK PN: C1005X5R1E104K050BC; Priority: A; Tolerance: 10%; C_Voltage: 6.3V; Voltage: 25V; PCB Footprint: C0402; Dielectric: X5R; Part Type: C0402; Manufacturer PN: C1005X5R1E104K050BC; Created by: JJJ
C146 = CAP NP_0: cap,100.00nF,+/-10%,25V,X5R,C0402; Manufacturer: TDK; RK PN: C1005X5R1E104K050BC; Priority: A; Tolerance: 10%; Voltage: 25V; PCB Footprint: C0402; Dielectric: X5R; Part Type: C0402; Manufacturer PN: C1005X5R1E104K050BC; Created by: JJJ
C147 = CAP NP_0: cap,10.00uF,+/-10%,25V,X5R,C1206; Manufacturer: TDK; RK PN: C3216X5R1E106K085AC; Priority: A; C_Voltage: 6.3V; Tolerance: 10%; Voltage: 25V; PCB Footprint: C1206; Dielectric: X5R; Part Type: C1206; Manufacturer PN: C3216X5R1E106K085AC; Created by: JJJ
C148 = CAP NP_0: cap,22.00pF,+/-5%,50V,C0G,C0402; Manufacturer: TDK; Manufacturer PN: C1005C0G1H220J050BA; Tolerance: 5%; Priority: A; Voltage: 50V; PCB Footprint: C0402; Dielectric: C0G; Created by: JJJ; Part Type: C0402; RK PN: C1005C0G1H220J050BA
C149 C155 = CAP NP_0: cap,22.00uF,+/-10%,10V,X5R,C0805; Manufacturer: TDK; RK PN: C2012X5R1A226K125AB; Priority: A; C_Voltage: 6.3V; Tolerance: 10%; Voltage: 10V; PCB Footprint: C0805; Dielectric: X5R; Part Type: C0805; Manufacturer PN: C2012X5R1A226K125AB; Created by: JJJ
C150 = CAP NP_0: cap,100.00nF,+/-10%,10V,X5R,C0402; Manufacturer: TDK; Number: 37; RK PN: C1005X5R1A104K050BA; Priority: A; Tolerance: 10%; C_Voltage: 6.3V; Voltage: 10V; PCB Footprint: C0402; Dielectric: X5R; Part Type: C0402; Manufacturer PN: C1005X5R1A104K050BA; Created by: JJJ
C151 = CAP NP_4: PCB Footprint: C0805
C152 = CAP NP: CAP,MLCC,1nF,+/-10%,X5R,6.3V,SMD0402; MARK: 22P; ROOM: USB+5V; PCB Footprint: C0402
C153 = CAP NP_0: cap,100.00nF,+/-10%,10V,X5R,C0402; Manufacturer PN: C1005X5R1A104K050BA; Manufacturer: TDK; C_Voltage: 6.3V; Tolerance: 10%; Priority: A; Number: 37; Voltage: 10V; PCB Footprint: C0402; Dielectric: X5R; Created by: JJJ; Part Type: C0402; RK PN: C1005X5R1A104K050BA
C154 C156 = CAP NP_0: cap,22.00uF,+/-10%,10V,X5R,C0805; Manufacturer PN: C2012X5R1A226K125AB; Manufacturer: TDK; Tolerance: 10%; C_Voltage: 6.3V; Priority: A; Voltage: 10V; PCB Footprint: C0805; Dielectric: X5R; Created by: JJJ; Part Type: C0805; RK PN: C2012X5R1A226K125AB
C90478 C90479 C90490 = CAP NP_0_Dup2: cap,22.00uF,+/-10%,10V,X5R,C0805; Manufacturer: TDK; RK PN: C2012X5R1A226K125AB; Priority: A; C_Voltage: 6.3V; Tolerance: 10%; Voltage: 10V; PCB Footprint: C0805; Dielectric: X5R; Part Type: C0805; Manufacturer PN: C2012X5R1A226K125AB; Created by: JJJ
C90480 = CAP NP_0_Dup2: cap,10.00uF,+/-10%,25V,X5R,C1206; Manufacturer: TDK; RK PN: C3216X5R1E106K085AC; Priority: A; C_Voltage: 6.3V; Tolerance: 10%; Voltage: 25V; PCB Footprint: C1206; Dielectric: X5R; Part Type: C1206; Manufacturer PN: C3216X5R1E106K085AC; Created by: JJJ
C90481 = CAP NP_0_Dup2: Did Not Place.; Number: 37; RK PN: DNPC0402; Priority: A; C_Voltage: 6.3V; PCB Footprint: C0201; Part Type: DNP; Manufacturer PN: DNPC0402; Created by: JJJ
C90482 = CAP NP_0_Dup2: cap,1.00uF,+/-10%,10V,X5R,C0402; Manufacturer PN: C1005X5R1A105K050BB; Manufacturer: TDK; C_Voltage: 6.3V; Tolerance: 10%; Priority: A; Number: 37; Voltage: 10V; PCB Footprint: C0201; Dielectric: X5R; Created by: JJJ; Part Type: C0402; RK PN: C1005X5R1A105K050BB
C90483 = CAP NP_0_Dup2: cap,100.00nF,+/-10%,50V,X5R,C0603; Manufacturer PN: C1608X5R1H104K080AA; Manufacturer: TDK; Tolerance: 10%; Priority: A; Voltage: 50V; PCB Footprint: C0402; Dielectric: X5R; Created by: JJJ; Part Type: C0603; RK PN: C1608X5R1H104K080AA
C90484 = CAP NP_0_Dup2: cap,10.00uF,+/-10%,25V,X5R,C1206; Manufacturer PN: C3216X5R1E106K085AC; Manufacturer: TDK; Tolerance: 10%; C_Voltage: 6.3V; Priority: A; Voltage: 25V; PCB Footprint: C1206; Dielectric: X5R; Created by: JJJ; Part Type: C1206; RK PN: C3216X5R1E106K085AC
C90485 = CAP NP_0_Dup2: cap,22.00uF,+/-10%,10V,X5R,C0805; Manufacturer PN: C2012X5R1A226K125AB; Manufacturer: TDK; Tolerance: 10%; C_Voltage: 6.3V; Priority: A; Voltage: 10V; PCB Footprint: C0805; Dielectric: X5R; Created by: JJJ; Part Type: C0805; RK PN: C2012X5R1A226K125AB
C90486 = CAP NP_0_Dup2: cap,100.00nF,+/-10%,10V,X5R,C0402; Manufacturer: TDK; Number: 37; RK PN: C1005X5R1A104K050BA; Priority: A; Tolerance: 10%; C_Voltage: 6.3V; Voltage: 10V; PCB Footprint: C0201; Dielectric: X5R; Part Type: C0402; Manufacturer PN: C1005X5R1A104K050BA; Created by: JJJ
C90487 = CAP NP_0_Dup2: cap,100.00nF,+/-10%,25V,X5R,C0402; Manufacturer: TDK; Option: DNP; Number: 37; RK PN: C1005X5R1E104K050BC; Priority: A; Tolerance: 10%; C_Voltage: 6.3V; Voltage: 25V; PCB Footprint: C0201; Dielectric: X5R; Part Type: C0402; Manufacturer PN: C1005X5R1E104K050BC; Created by: JJJ
C90488 = CAP NP_0_Dup2: cap,100.00nF,+/-10%,10V,X5R,C0402; Manufacturer PN: C1005X5R1A104K050BA; Manufacturer: TDK; C_Voltage: 6.3V; Tolerance: 10%; Priority: A; Number: 37; Voltage: 10V; PCB Footprint: C0402; Dielectric: X5R; Created by: JJJ; Part Type: C0402; RK PN: C1005X5R1A104K050BA
C90489 = CAP NP_0_Dup2: cap,220.00nF,+/-10%,25V,X5R,C0402; Manufacturer: TDK; Number: 37; RK PN: C1005X5R1E224K050BC; Priority: A; Tolerance: 10%; C_Voltage: 6.3V; Voltage: 25V; PCB Footprint: C0402; Dielectric: X5R; Part Type: C0402; Manufacturer PN: C1005X5R1E224K050BC; Created by: JJJ
D45 = DIODE: Schottky Barrier，SS32 DO214AC; Manufacturer: 星海; ROOM: CHG; RK PN: SS32; Priority: A; PCB Footprint: DO_214AC; Part Type: Schottky rectifier; Manufacturer PN: SS32; Created by: JJJ
D46 = DIODE: Schottky Barrier，SS32 DO214AC; Manufacturer PN: SS32; Manufacturer: 星海; Priority: A; ROOM: CHG; PCB Footprint: DO_214AC; Created by: JJJ; Part Type: Schottky rectifier; RK PN: SS32
D47 = DIODE ZENER1: 1-Line, Uni-directional, Transient Voltage Suppressor; Manufacturer: WillSemi(韦尔半导体); RK PN: ESD5621W-2/TR; Priority: A; PCB Footprint: SOD_123; Part Type: ESD_TVS; Manufacturer PN: ESD5621W-2/TR; Created by: JJJ
L12 = INDUCTORS OF FERRITE: PCB Footprint: IND-5020
L13 = INDUCTORS OF FERRITE_Dup1: Power Inductor,4.7uH,0.2,IND_606045; Manufacturer PN: SWPA6045S4R7MT; Manufacturer: sunlord; DC Resistor: 0.02ohm; Isat: 4.97A; Resonace frequency: 24M; Irms: 3.3A; Tolerance: 20%; Priority: A; PCB Footprint: IND-5020; Created by: YWQ; Part Type: POWER_IND; RK PN: SWPA6045S4R7MT
L5002 = INDUCTORS OF FERRITE_Dup1: Power Inductor,1.5uH,MWSA0603S-1R5MT; Manufacturer: Vishay; Isat: 9.6A; Option: >8A; Irms: 10.5A; Tolerance: 20%; Priority: A; PCB Footprint: IND-5020; Created by: JJJ; Part Type: IND
P4 P6 = TESTPOINT1: PCB Footprint: TP_0R70
R147 = RESISTOR_0_Dup3: 通用厚膜电阻,3R3,+/-5%,R0402,1/16W.; Manufacturer: YAGEO; Tolerance: 5%; RK PN: RC0402JR-073R3L; Priority: A; Wattage: 1/16W; PCB Footprint: R0402; Part Type: 通用厚膜电阻; Manufacturer PN: RC0402JR-073R3L; Created by: YTL
R148 R150 = R_0: PCB Footprint: R1206
R149 R152 = RESISTOR_0_Dup3: 通用厚膜电阻,10K,+/-5%,R0402,1/16W.; Manufacturer PN: RC0402JR-0710KL; Manufacturer: YAGEO; Tolerance: 5%; Wattage: 1/16W; Priority: A; PCB Footprint: R0402; Created by: YTL; Part Type: 通用厚膜电阻; RK PN: RC0402JR-0710KL
R151 R154 = RESISTOR_2: 通用厚膜电阻,10K,+/-5%,R0402,1/16W.; Manufacturer PN: RC0402JR-0710KL; Manufacturer: YAGEO; Tolerance: 5%; Wattage: 1/16W; Priority: A; PCB Footprint: R0402; Created by: YTL; Part Type: 通用厚膜电阻; RK PN: RC0402JR-0710KL
R153 R155 = RESISTOR_2: 通用厚膜电阻,10K,+/-5%,R0402,1/16W.; Manufacturer: YAGEO; Tolerance: 5%; RK PN: RC0402JR-0710KL; Priority: A; Wattage: 1/16W; PCB Footprint: R0402; Part Type: 通用厚膜电阻; Manufacturer PN: RC0402JR-0710KL; Created by: YTL
R156 R159 = RESISTOR_0_Dup3: 通用厚膜电阻,100K,+/-5%,R0402,1/16W.; Manufacturer: YAGEO; Tolerance: 5%; RK PN: RC0402JR-07100KL; Priority: A; Wattage: 1/16W; PCB Footprint: R0402; Part Type: 通用厚膜电阻; Manufacturer PN: RC0402JR-07100KL; Created by: YTL
R157 = RESISTOR_0_Dup3: 通用厚膜电阻,232K,+/-1%,R0402,1/16W.; Manufacturer: YAGEO; Tolerance: 1%; RK PN: RC0402FR-07232KL; Priority: A; Wattage: 1/16W; PCB Footprint: R0402; Part Type: 通用厚膜电阻; Manufacturer PN: RC0402FR-07232KL; Created by: YTL
R158 R95572 = RESISTOR_0_Dup3: 通用厚膜电阻,100K,+/-5%,R0402,1/16W.; Manufacturer PN: RC0402JR-07100KL; Manufacturer: YAGEO; Tolerance: 5%; Wattage: 1/16W; Priority: A; PCB Footprint: R0402; Created by: YTL; Part Type: 通用厚膜电阻; RK PN: RC0402JR-07100KL
R160 = RESISTOR_0_Dup3: 通用厚膜电阻,24K,+/-5%,R0402,1/16W.; Manufacturer: YAGEO; Tolerance: 5%; RK PN: RC0402JR-0724KL; Priority: A; Wattage: 1/16W; PCB Footprint: R0402; Part Type: 通用厚膜电阻; Manufacturer PN: RC0402JR-0724KL; Created by: YTL
R161 = RESISTOR_0_Dup3: 通用厚膜电阻,49K9,+/-1%,R0402,1/16W.; Manufacturer PN: RC0402FR-0749K9L; Manufacturer: YAGEO; Tolerance: 1%; Wattage: 1/16W; Priority: A; PCB Footprint: R0402; Created by: YTL; Part Type: 通用厚膜电阻; RK PN: RC0402FR-0749K9L
R95113 R95119 = RESISTOR_1_Dup1: 通用厚膜电阻,100K,+/-5%,R0402,1/16W.; Manufacturer: YAGEO; PCB Footprint: R0201; Tolerance: 5%; RK PN: RC0402JR-07100KL; Priority: A; Wattage: 1/16W; Part Type: 通用厚膜电阻; Manufacturer PN: RC0402JR-07100KL; Created by: YTL
R95114 = RESISTOR_1_Dup1: as R95555 on sheet 13_USB30_USB20; Created by: YTL; Part Type: 通用厚膜电阻; RK PN: RC0402JR-07100KL
R95115 = RESISTOR_1_Dup1: 通用厚膜电阻,3R3,+/-5%,R0402,1/16W.; Manufacturer: YAGEO; Tolerance: 5%; RK PN: RC0402JR-073R3L; Priority: A; Wattage: 1/16W; PCB Footprint: R0402; Part Type: 通用厚膜电阻; Manufacturer PN: RC0402JR-073R3L; Created by: YTL
R95116 = RESISTOR_1_Dup1: 通用厚膜电阻,7K5,+/-1%,R0402,1/16W.; Manufacturer: YAGEO; PCB Footprint: R0201; Tolerance: 1%; RK PN: RC0402FR-077K5L; Priority: A; Wattage: 1/16W; Part Type: 通用厚膜电阻; Manufacturer PN: RC0402FR-077K5L; Created by: YTL
R95117 = RESISTOR_1_Dup1: 通用厚膜电阻,100K,+/-5%,R0402,1/16W.; Manufacturer PN: RC0402JR-07100KL; Manufacturer: YAGEO; PCB Footprint: R0201; Tolerance: 5%; Wattage: 1/16W; Priority: A; Option: DNP; Created by: YTL; Part Type: 通用厚膜电阻; RK PN: RC0402JR-07100KL
R95118 = RESISTOR_1_Dup1: Did Not Place.; Manufacturer PN: DNPR0402; PCB Footprint: R0201; Priority: A; Created by: JJJ; Part Type: DNP; RK PN: DNPR0402
R95120 = RESISTOR_1_Dup1: 通用厚膜电阻,43K,+/-1%,R0402,1/16W.; Manufacturer PN: RC0402FR-0743KL; Manufacturer: YAGEO; PCB Footprint: R0201; Tolerance: 1%; Wattage: 1/16W; Priority: A; Created by: YTL; Part Type: 通用厚膜电阻; RK PN: RC0402FR-0743KL
R95121 = RESISTOR_1_Dup1: Did Not Place.; PCB Footprint: R0201; RK PN: DNPR0402; Priority: A; Part Type: DNP; Manufacturer PN: DNPR0402; Created by: JJJ
R95122 = RESISTOR_1_Dup1: 通用厚膜电阻,510K,+/-5%,R0402,1/16W.; Manufacturer: YAGEO; PCB Footprint: R0201; Tolerance: 5%; RK PN: RC0402JR-07510KL; Priority: A; Wattage: 1/16W; Part Type: 通用厚膜电阻; Manufacturer PN: RC0402JR-07510KL; Created by: YTL
TP9 TP10 = TP: as TP14 on sheet 14_FAN_RTC; Part Type: TP; Created by: JJJ
TP11 = TP: as TP16 on sheet 14_FAN_RTC; Created by: JJJ; Part Type: TP
U1 = MP8759_6: PCB Footprint: QFN12_2R00X3R00X1R00
U27 = DCDC_NB679: 26 V, Low Iq, High Current, Fixed 5 V-8 A Synchronous Buck Converter with 100 mA LDO;; Manufacturer: MPS （美国芯源）; PCB Footprint: QFN12_2R00X3R00X1R00; RK PN: NB679GD; Priority: A; Part Type: DCDC; Manufacturer PN: NB679GD; Created by: JJJ
U28 = CON3_2: PCB Footprint: XIAO_4PIN_2D54
U29 = DCDC_SY8113: Manufacturer: Silergy（矽力杰）; Priority: A; PCB Footprint: SOT_23_6; RK PN: SY8113B; Part Type: DCDC; Manufacturer PN: SY8113B; Created by: JJJ
U37 = CON3_0: PCB Footprint: DC-044A
*#15 = radxa_1010: Page Create Date: March  8, 1995; Page Modify Date: *

## Sheet 16_40PIN_Connector.SchDoc
size 297 x 209 mm
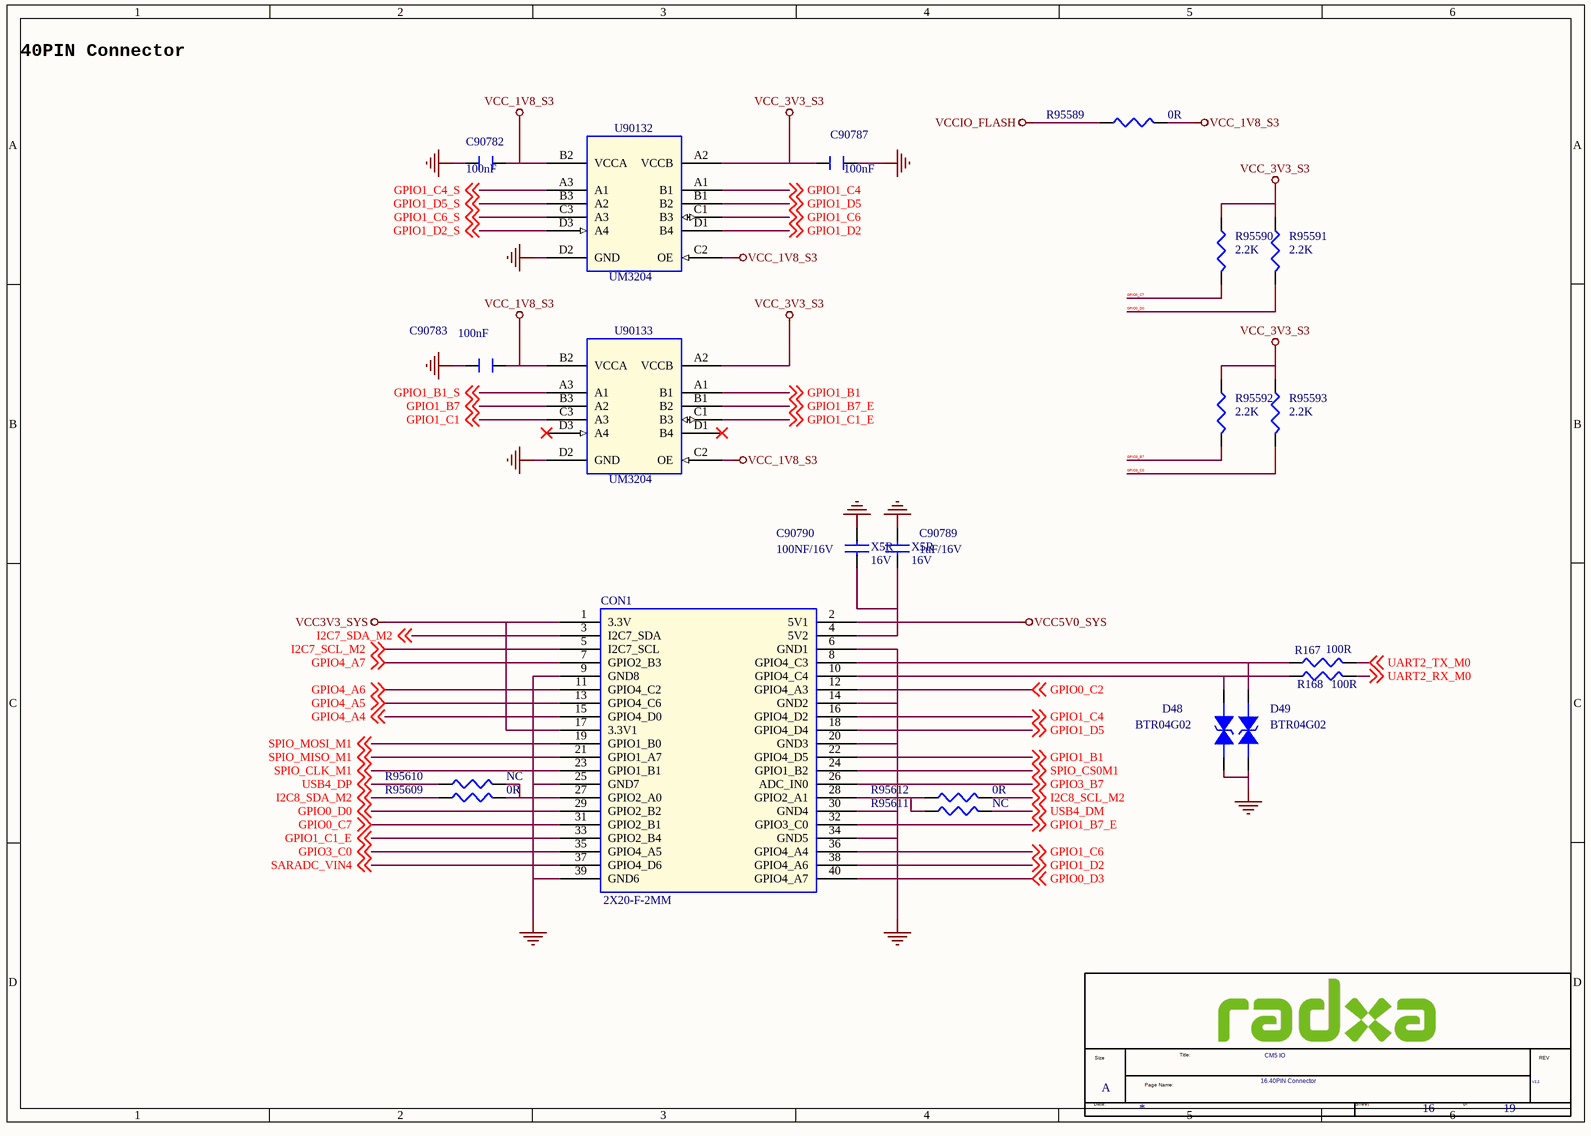
[diagram p15: 16_40PIN_Connector.SchDoc]

### Parts
(Parts that share a designator on the sheet are numbered #1, #2 ... from top to bottom, then left to right.)
*#16  Doc: 16.40PIN Connector  RevCode: V2.2  Title: CM5 IO  Page Size: A  Page Number: 16  Page Count: 19  (hidden comment: radxa_1010)  (graphical)
C90782  100nF  [C0402]
C90783  100nF  [C0402]
C90787  100nF  [C0402]
C90789  1uF/16V  Voltage: 16V  Dielectric: X5R  [C0402]
C90790  100NF/16V  Voltage: 16V  Dielectric: X5R  [C0402]
CON1  2X20-F-2MM  [DIP40PIN_2D54MM]
D48  BTR04G02  [ESD0402_1XD5]
D49  BTR04G02  [ESD0402_1XD5]
R167  100R  [R0402]
R168  100R  [R0402]
R95589  0R  [R0402]
R95590  2.2K  [R0402]
R95591  2.2K  [R0402]
R95592  2.2K  [R0402]
R95593  2.2K  [R0402]
R95609  0R  [R0402]
R95610  NC  [R0402]
R95611  NC  [R0402]
R95612  0R  [R0402]
U90132  UM3204  [CSP-12]
U90133  UM3204  [CSP-12]

### Nets
GND: C90782.1 C90783.1 C90787.1 C90789.2 C90790.2 CON1.6(GND1) CON1.9(GND8) CON1.14(GND2) CON1.20(GND3) CON1.25(GND7) CON1.30(GND4) CON1.34(GND5) CON1.39(GND6) D48.1 D49.1 U90132.D2(GND) U90133.D2(GND)
VCC3V3_SYS: CON1.1(3.3V) CON1.17(3.3V1)
VCC5V0_SYS: C90789.1 C90790.1 CON1.2(5V1) CON1.4(5V2)
VCC_1V8_S3: C90782.2 C90783.2 R95589.2 U90132.B2(VCCA) U90132.C2(OE) U90133.B2(VCCA) U90133.C2(OE)
VCC_3V3_S3: C90787.2 R95590.1 R95591.1 R95592.1 R95593.1 U90132.A2(VCCB) U90133.A2(VCCB)
VCCIO_FLASH: R95589.1
GPIO0_C2: CON1.12(GPIO4_A3) ; off-sheet GPIO0_C2
GPIO0_C7: CON1.31(GPIO2_B1) R95590.2 ; off-sheet GPIO0_C7
GPIO0_D0: CON1.29(GPIO2_B2) R95591.2 ; off-sheet GPIO0_D0
GPIO0_D3: CON1.40(GPIO4_A7) ; off-sheet GPIO0_D3
GPIO1_B1: CON1.22(GPIO4_D5) U90133.A1(B1) ; off-sheet GPIO1_B1
GPIO1_B1_S: U90133.A3(A1) ; off-sheet GPIO1_B1_S
GPIO1_B7: U90133.B3(A2) ; off-sheet GPIO1_B7
GPIO1_B7_E: CON1.32(GPIO3_C0) U90133.B1(B2) ; off-sheet GPIO1_B7_E
GPIO1_C1: U90133.C3(A3) ; off-sheet GPIO1_C1
GPIO1_C1_E: CON1.33(GPIO2_B4) U90133.C1(B3) ; off-sheet GPIO1_C1_E
GPIO1_C4: CON1.16(GPIO4_D2) U90132.A1(B1) ; off-sheet GPIO1_C4
GPIO1_C4_S: U90132.A3(A1) ; off-sheet GPIO1_C4_S
GPIO1_C6: CON1.36(GPIO4_A4) U90132.C1(B3) ; off-sheet GPIO1_C6
GPIO1_C6_S: U90132.C3(A3) ; off-sheet GPIO1_C6_S
GPIO1_D2: CON1.38(GPIO4_A6) U90132.D1(B4) ; off-sheet GPIO1_D2
GPIO1_D2_S: U90132.D3(A4) ; off-sheet GPIO1_D2_S
GPIO1_D5: CON1.18(GPIO4_D4) U90132.B1(B2) ; off-sheet GPIO1_D5
GPIO1_D5_S: U90132.B3(A2) ; off-sheet GPIO1_D5_S
GPIO3_B7: CON1.26(ADC_IN0) R95592.2 ; off-sheet GPIO3_B7
GPIO3_C0: CON1.35(GPIO4_A5) R95593.2 ; off-sheet GPIO3_C0
GPIO4_A4: CON1.15(GPIO4_D0) ; off-sheet GPIO4_A4
GPIO4_A5: CON1.13(GPIO4_C6) ; off-sheet GPIO4_A5
GPIO4_A6: CON1.11(GPIO4_C2) ; off-sheet GPIO4_A6
GPIO4_A7: CON1.7(GPIO2_B3) ; off-sheet GPIO4_A7
I2C7_SCL_M2: CON1.5(I2C7_SCL) ; off-sheet I2C7_SCL_M2
I2C7_SDA_M2: CON1.3(I2C7_SDA) ; off-sheet I2C7_SDA_M2
I2C8_SCL_M2: R95612.2 ; off-sheet I2C8_SCL_M2
I2C8_SDA_M2: R95609.1 ; off-sheet I2C8_SDA_M2
SARADC_VIN4: CON1.37(GPIO4_D6) ; off-sheet SARADC_VIN4
SPIO_CLK_M1: CON1.23(GPIO1_B1) ; off-sheet SPIO_CLK_M1
SPIO_CS0M1: CON1.24(GPIO1_B2) ; off-sheet SPIO_CS0M1
SPIO_MISO_M1: CON1.21(GPIO1_A7) ; off-sheet SPIO_MISO_M1
SPIO_MOSI_M1: CON1.19(GPIO1_B0) ; off-sheet SPIO_MOSI_M1
UART2_RX_M0: R168.2 ; off-sheet UART2_RX_M0
UART2_TX_M0: R167.2 ; off-sheet UART2_TX_M0
USB4_DM: R95611.2 ; off-sheet USB4_DM
USB4_DP: R95610.1 ; off-sheet USB4_DP
NetCON1_8: CON1.8(GPIO4_C3) D49.2 R167.1
NetCON1_10: CON1.10(GPIO4_C4) D48.2 R168.1
NetCON1_27: CON1.27(GPIO2_A0) R95609.2 R95610.2
NetCON1_28: CON1.28(GPIO2_A1) R95611.1 R95612.1

Not connected (* = marked no-connect by the designer): U90133 D1(B4)* D3(A4)*

### Notes on the sheet
- 40PIN Connector
- (in symbol radxa_1010) Size; Title:; REV; Page Name:; Date:; Sheet; of

### Library data of the parts
C90782 C90783 C90787 = CAPACITOR_0: PAGE: 1; PCB Footprint: C0402
C90789 = CAP NP_0: as C144 on sheet 15_Power_DCIN; PCB Footprint: C0402; Created by: JJJ; Part Type: C0402; RK PN: C1005X5R1C105K050BC
C90790 = CAP NP_0: as C141 on sheet 15_Power_DCIN; PCB Footprint: C0402; Part Type: C0402; Manufacturer PN: C1005X5R1C104K050BA; Created by: JJJ
CON1 = CN_0_Dup1: PCB Footprint: DIP40PIN_2D54MM
D48 = DIODE BI_DIR TRIG_2: 1-Line, Bi-directional, Transient Voltage Suppressors.17.5pF.; Manufacturer PN: ESD5451N; Manufacturer: WillSemi(韦尔半导体); OPTION: DNP; Priority: A; PCB Footprint: ESD0402_1XD5; Created by: JJJ; Part Type: ESD_TVS; RK PN: ESD5451N
D49 = DIODE BI_DIR TRIG_2: 1-Line, Bi-directional, Transient Voltage Suppressors.17.5pF.; Manufacturer: WillSemi(韦尔半导体); RK PN: ESD5451N; Priority: A; OPTION: DNP; PCB Footprint: ESD0402_1XD5; Part Type: ESD_TVS; Manufacturer PN: ESD5451N; Created by: JJJ
R167 = RESISTOR_0_Dup3: 通用厚膜电阻,100R,+/-5%,R0402,1/16W.; Manufacturer: YAGEO; Tolerance: 5%; RK PN: RC0402JR-07100RL; Priority: A; Wattage: 1/16W; PCB Footprint: R0402; Part Type: 通用厚膜电阻; Manufacturer PN: RC0402JR-07100RL; Created by: YTL
R168 = RESISTOR_0_Dup3: 通用厚膜电阻,100R,+/-5%,R0402,1/16W.; Manufacturer PN: RC0402JR-07100RL; Manufacturer: YAGEO; Tolerance: 5%; Wattage: 1/16W; Priority: A; PCB Footprint: R0402; Created by: YTL; Part Type: 通用厚膜电阻; RK PN: RC0402JR-07100RL
R95589 R95591 R95592 R95610 R95611 = RESISTOR_3: 通用厚膜电阻,2K2,+/-5%,R0402,1/16W.; Manufacturer: YAGEO; Tolerance: 5%; RK PN: RC0402JR-072K2L; Priority: A; Wattage: 1/16W; PCB Footprint: R0402; Part Type: 通用厚膜电阻; Manufacturer PN: RC0402JR-072K2L; Created by: YTL
R95590 R95593 R95609 R95612 = RESISTOR_3: 通用厚膜电阻,2K2,+/-5%,R0402,1/16W.; Manufacturer PN: RC0402JR-072K2L; Manufacturer: YAGEO; Tolerance: 5%; Wattage: 1/16W; Priority: A; PCB Footprint: R0402; Created by: YTL; Part Type: 通用厚膜电阻; RK PN: RC0402JR-072K2L
U90132 U90133 = MP2610_0: 4-bit Bi-directional Level Shifter  UM3204H; Part Number: PI4ULS5V104GAEX; Vendor: PERICOM; PCB Footprint: CSP-12
*#16 = radxa_1010: Page Create Date: March  8, 1995; Page Modify Date: *